# Altium schematic sheet Sheet3.SchDoc
size 381 x 241 mm; SheetNumber: 2; SheetTotal: 2
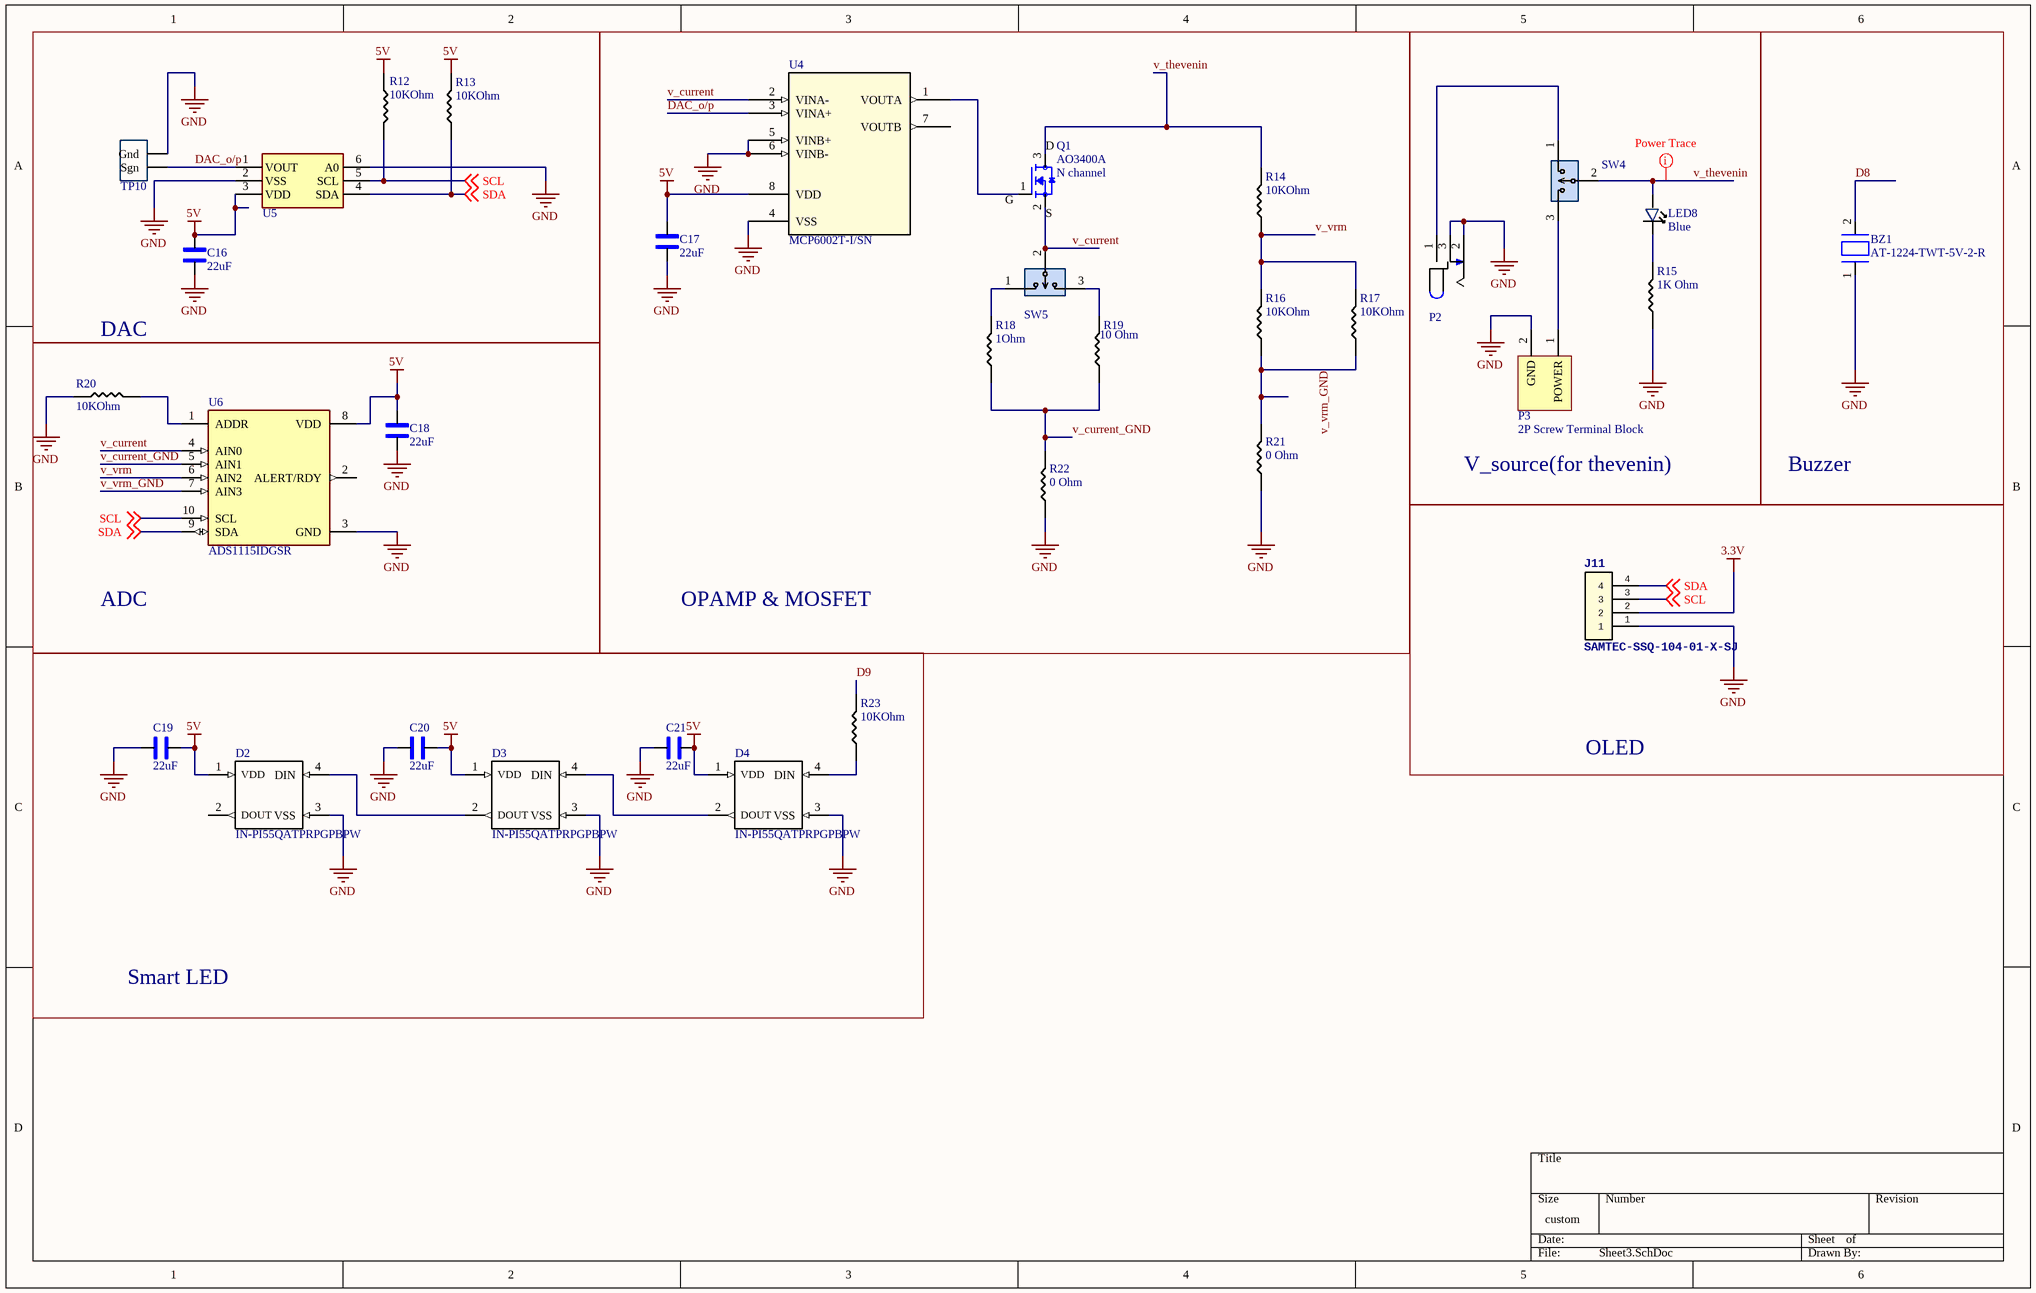
[diagram p0: Sheet3.SchDoc]

## Parts
BZ1  AT-1224-TWT-5V-2-R  [BUZZER- TH]
C16  22uF  [1206_Passive_Capacitor]
C17  22uF  [1206_Passive_Capacitor]
C18  22uF  [1206_Passive_Capacitor]
C19  22uF  [1206_Passive_Capacitor]
C20  22uF  [1206_Passive_Capacitor]
C21  22uF  [1206_Passive_Capacitor]
D2  IN-PI55QATPRPGPBPW  [SERIAL_LED - duplicate]
D3  IN-PI55QATPRPGPBPW  [SERIAL_LED - duplicate]
D4  IN-PI55QATPRPGPBPW  [SERIAL_LED - duplicate]
J11  SAMTEC-SSQ-104-01-X-SJ  [JF-4_SSQ-104-01-X-S]
LED8  Blue  [LED_1206]
P2  Power Jack  [Power_Jack]  (value not drawn)
P3  2P Screw Terminal Block  [P_Terminal block 3.5mm-pitch]
Q1  AO3400A  value N channel  [N-MOSFET]
R12  value 10KOhm  [1206_Passive_Resitor]  (hidden comment: 10k)
R13  value 10KOhm  [1206_Passive_Resitor]  (hidden comment: 10k)
R14  value 10KOhm  [1206_Passive_Resitor]  (hidden comment: 10k)
R15  value 1K Ohm  [1206_Passive_Resitor]  (hidden comment: 1k)
R16  value 10KOhm  [1206_Passive_Resitor]  (hidden comment: 10k)
R17  value 10KOhm  [1206_Passive_Resitor]  (hidden comment: 10k)
R18  value 1Ohm  [1206_Passive_Resitor]  (hidden comment: 1 Ohm)
R19  10 Ohm  [1206_Passive_Resitor]
R20  value 10KOhm  [1206_Passive_Resitor]  (hidden comment: 10k)
R21  0 Ohm  [1206_Passive_Resitor]
R22  0 Ohm  [1206_Passive_Resitor]
R23  value 10KOhm  [1206_Passive_Resitor]  (hidden comment: 10k)
SW4  PREC003SAAN-RC  [3_PIN_100mil]  (value not drawn)
SW5  PREC003SAAN-RC  [3_PIN_100mil]  (value not drawn)
TP10  10x Probe TP  [TP10x_Probe]  (value not drawn)
U4  MCP6002T-I/SN  [SOIC127P600X175-8N]
U5  DAC IC  [MCP4725]  (value not drawn)
U6  ADS1115IDGSR  [ADC_ADS1115IDGSR]

## Blocks framed on the sheet
DAC: C16 R12 R13 TP10 U5
OPAMP & MOSFET: C17 Q1 R14 R16-R19 R21 R22 SW5 U4
V_source(for thevenin): LED8 P2 P3 R15 SW4
Buzzer: BZ1
ADC: C18 R20 U6
OLED: J11
Smart LED: C19-C21 D2-D4 R23

## Nets
3.3V: J11.2
5V: C16.2 C17.2 C18.2 C19.1 C20.1 C21.1 D2.1(VDD) D3.1(VDD) D4.1(VDD) R12.1 R13.2 U4.8(VDD) U5.3(VDD) U6.8(VDD)
GND: BZ1.1(BZ1) C16.1 C17.1 C18.1 C19.2 C20.2 C21.2 D2.3(VSS) D3.3(VSS) D4.3(VSS) J11.1 P2.2 P2.3 P3.2(GND) R15.1 R20.1 R21.1 R22.1 TP10.2(Gnd) U4.4(VSS) U4.5(VINB+) U4.6(VINB-) U5.2(VSS) U5.6(A0) U6.3(GND)
D8: BZ1.2(BZ2)
D9: R23.2
DAC_o/p: TP10.1(Sgn) U4.3(VINA+) U5.1(VOUT)
SCL: J11.3 R12.2 U5.5(SCL) U6.10(SCL) ; off-sheet SCL
SDA: J11.4 R13.1 U5.4(SDA) U6.9(SDA) ; off-sheet SDA
v_current: Q1.2(S) SW5.2 U4.2(VINA-) U6.4(AIN0)
v_current_GND: R18.1 R19.1 R22.2 U6.5(AIN1)
v_thevenin: LED8.1 Q1.3(D) R14.2 SW4.2
v_vrm: R14.1 R16.2 R17.2 U6.6(AIN2)
v_vrm_GND: R16.1 R17.1 R21.2 U6.7(AIN3)
NetD2_4: D2.4(DIN) D3.2(DOUT)
NetD3_4: D3.4(DIN) D4.2(DOUT)
NetD4_4: D4.4(DIN) R23.1
NetLED8_2: LED8.2 R15.2
NetP2_1: P2.1 SW4.1
NetP3_1: P3.1(POWER) SW4.3
NetQ1_1: Q1.1(G) U4.1(VOUTA)
NetR18_2: R18.2 SW5.1
NetR19_2: R19.2 SW5.3
NetR20_2: R20.2 U6.1(ADDR)

Not connected (* = marked no-connect by the designer): D2 2(DOUT); U4 7(VOUTB); U6 2(ALERT/RDY)

## Layout directives
rule Width Constraint [Pref Width = 20mil    Min Width = 10mil    Max Width = 100mil]: v_thevenin

## Library data of the parts
BZ1 = BUZZER_1: Buzzers Transducer, Externally Driven Electromechanical/Magnetic 5 V 40mA 2.4kHz 87dB @ 5V, 10cm Through Hole PC Pins; Datasheet: https://www.puiaudio.com/media/SpecSheet/AT-1224-TWT-5V-2-R.pdf; MFR Part #: AT-1224-TWT-5V-2-R
C16-C21 = C_22uF_1206: 22uF ±10% 25V X5R 1206 Multilayer Ceramic Capacitors MLCC - SMD/SMT RoHS; MFR Part #: CL31A226KAHNNNE; Type: basic; LCSC Part#: C12891; Datasheet: https://datasheet.lcsc.com/lcsc/1811031514_Samsung-Electro-Mechanics-CL31A226KAHNNNE_C12891.pdf; Value: 22uF
D2-D4 = LED_Smart: LIGHT EMITTING DIODES (LED) RGB 620~630NM RED, 520~530NM GREEN, 465~475NM BLUE 600MCD@16MARED,1200MCD@16MAGREEN,300MCD@16MABLUE TOP VIEW SMD-4 ROHS; MFR Part #: XL-5050RGBC-WS2812B; Manufacturer: XINGLIGHT; LCSC Part#: C2843785; DataSheet: https://datasheet.lcsc.com/lcsc/2301111130_XINGLIGHT-XL-5050RGBC-WS2812B_C2843785.pdf
J11 = JF_4_PIN_FEMALE: 2.54mm 3A bronze -40℃~+105℃ Straight 1x4P Top 4 1 Square Holes Straight,P=2.54mm  Female Headers ROHS; MFR PART #: SSQ-104-01-X-SJ; LCSC PART#: C2718488
LED8 = LED_BLUE_1206: blue 1206  Light Emitting Diodes (LED) ROHS; MFR Part #: NCD1206B1; Type: Extended; LCSC Part#: C130717; Datasheet: https://datasheet.lcsc.com/lcsc/2008201033_Foshan-NationStar-Optoelectronics-NCD1206B1_C130717.pdf; Value: Blue
P2 = P_Power Jack: Power Barrel Connector Jack 2.10mm ID (0.083"), 5.50mm OD (0.217") Through Hole, Right Angle; MFR Part #: PJ-102A; Value: CONN PWR JACK 2X5.5MM SOLDER; Digikey Link: https://www.digikey.com/product-detail/en/PJ-102A/CP-102A-ND/275425/?itemSeq=304982367; LCSC Part#: C136744; Type: Extended
P3 = P_Terminal block: Green Straight pin 3.5mm  pitch; P=3.5mm  Screw terminal ROHS; MFR Part #: KF350-3.5-2P; Manufacturer: Cixi Kefa Elec; LCSC Part#: C474892; DataSheet: https://datasheet.lcsc.com/lcsc/2001160007_Cixi-Kefa-Elec-KF350-3-5-2P_C474892.pdf
Q1 = Q_Nch_MOSFET: MOSFET N Trench 30V 5.7A 1.5V @ 250uA 26.5 m? @ 5.7A,10V SOT-23-3L RoHS; Type: Basic; LCSC Part#: C20917; Datasheet: https://datasheet.lcsc.com/szlcsc/Alpha-Omega-Semicon-AOS-AO3400A_C20917.pdf; MFR Part #: AO3400A
R12-R14 R16 R17 R20 R23 = R_10KOhm_1206: 10 kOhms ±5% 0.25W, 1/4W Chip Resistor 1206 (3216 Metric) Automotive AEC-Q200 Thick Film; MFR Part #: RMCF1206FT10K0; Digikey Link: https://www.digikey.com/en/products/detail/stackpole-electronics-inc/RMCF1206FT10K0/1759669; LCSC Part#: C17902; Type: Basic
R15 = R_1K_1206: CHIP RESISTOR - SURFACE MOUNT 1KOHMS ±1% 1/4W 1206 ROHS; MFR Part #: RNCP1206FTD1K00CT; Digikey Link: https://www.digikey.com/product-detail/en/RNCP1206FTD1K00/RNCP1206FTD1K00CT-ND/2240675/?itemSeq=304982373; LCSC Part#: C4410; Type: Basic
R18 = R_1Ohm_1206: 1Ω ±5% 0.25W ±400ppm/℃ 1206 Chip Resistor - Surface Mount RoHS; MFR Part #: 1206W4J010JT5E; LCSC Part#: C1409; Datasheet: https://datasheet.lcsc.com/lcsc/1810301410_UNI-ROYAL-Uniroyal-Elec-1206W4J010JT5E_C1409.pdf; Type: Extended
R19 = R_10Ohm_1206: CHIP RESISTOR - SURFACE MOUNT 0.1OHMS ±1% 1/4W 1206 ROHS; MFR Part #: 1206W4F100JT5E; Datasheet: https://datasheet.lcsc.com/szlcsc/Uniroyal-Elec-1206W4F100JT5E_C17903.pdf; LCSC Part#: C17903; Type: Basic; Value: 10 Ohm
R21 R22 = R_0Ohm_1206: CHIP RESISTOR - SURFACE MOUNT 0OHMS ±1% 1/4W 1206 ROHS; MFR Part #: 1206W4F0000T5E; Datasheet: https://datasheet.lcsc.com/szlcsc/Uniroyal-Elec-1206W4F0000T5E_C17888.pdf; LCSC Part#: C17888; Type: Basic; Mouser link: https://www.mouser.com/ProductDetail/Royalohm/1206W4F0000T5E?qs=e8oIoAS2J1Thbopin%252BsagQ%3D%3D; Value: 0 Ohm
SW4 SW5 = SW_3Pin_100mil_Switch: Connector Header Through Hole 3 position 0.100" (2.54mm); Value: CONN HEADER VERT 3POS 2.54MM; Digikey Link: https://www.digikey.com/product-detail/en/PREC003SAAN-RC/S1012EC-03-ND/2774851/?itemSeq=304982371; MFR Part #: PREC003SAAN-RC; Type: Extended; LCSC Part#: C49257
TP10 = TP_10x_Probe: Test Point 300 mil centers
U4 = U_MCP6002T-I/SN: 0.6 V/us 2 1MHz 1.8V ~ 6V 100μA General Purpose SOIC-8_150mil  Operational Amplifier ROHS; Mfr: Microchip; MFR Part #: MCP6002T-I/SN; DataSheet: https://ww1.microchip.com/downloads/en/DeviceDoc/MCP6001-1R-1U-2-4-1-MHz-Low-Power-Op-Amp-DS20001733L.pdf; LCSC Part#: C7377; Type: Basic
U5 = U_MCP4725A0T-E/CH: IC DAC 12BIT V-OUT SOT23-6; Datasheet: https://ww1.microchip.com/downloads/en/DeviceDoc/22039d.pdf; LCSC Part#: C144198; type: Extended; MFR Part #: MCP4725A0T-E/CH
U6 = U_ADC_ADS1115IDGSR: 16-Bit ADC with Integrated MUX, PGA, Comparator, Oscillator, and Reference 10-VSSOP -40 to 125; MFR Part #: ADS1115IDGSR; Package: MSOP-10 Texas Instruments; LCSC Part#: C37593; SnapEDA_Link: https://www.snapeda.com/parts/ADS1115IDGSR/Texas%20Instruments/view-part/?ref=snap; Type: Extended; DigiKey link: https://www.digikey.com/product-detail/en/texas-instruments/ADS1115IDGSR/296-38849-1-ND/5142969?utm_source=snapeda&utm_medium=aggregator&utm_campaign=symbol; Value: *